# Altium project CurrentSource.PrjPcb
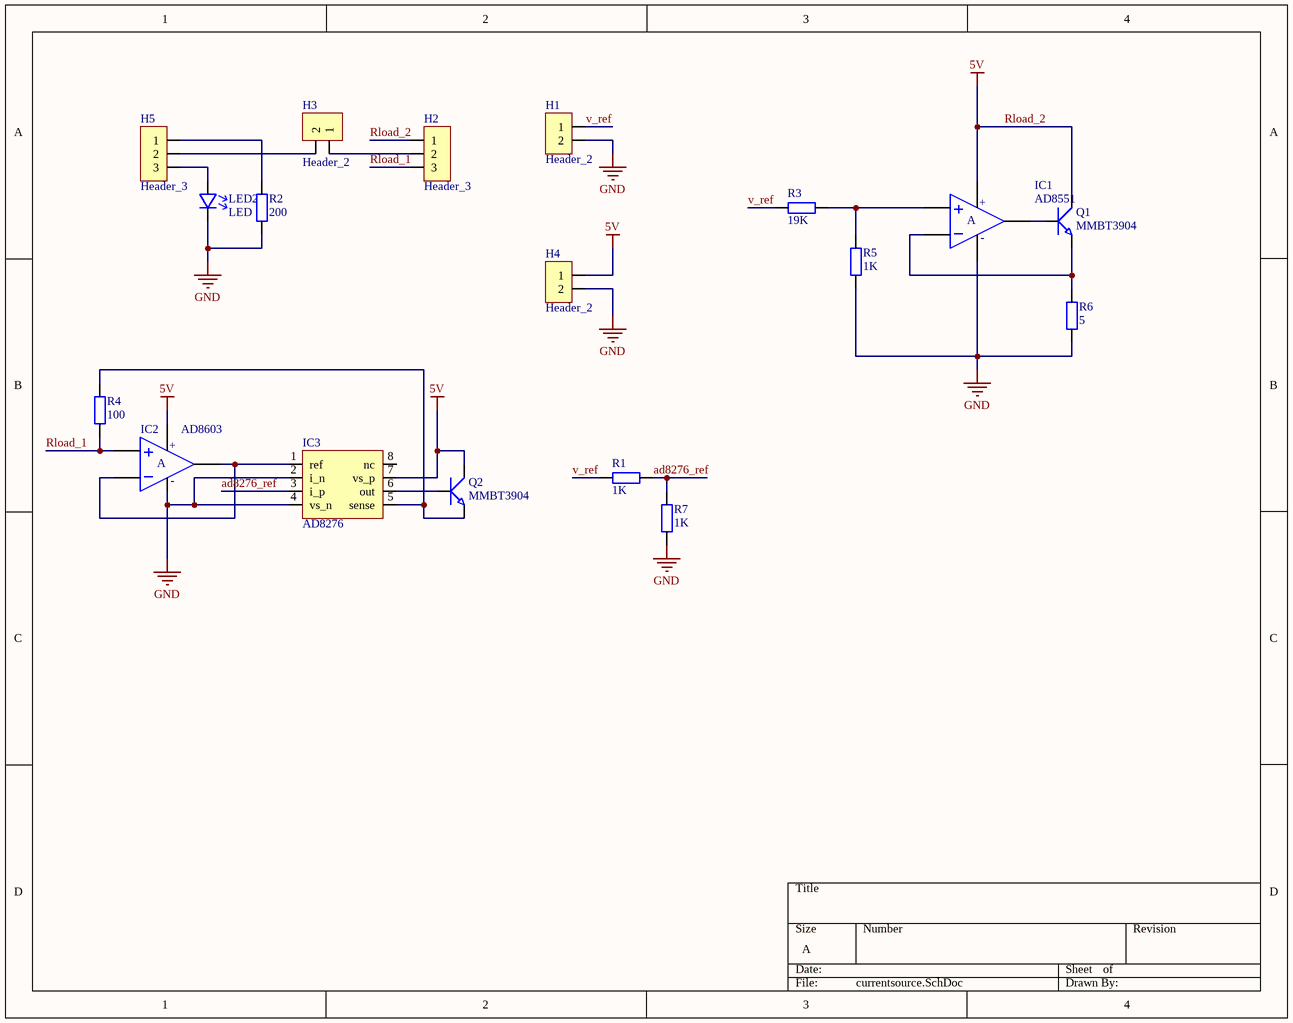
[diagram p0: currentsource.SchDoc]
1 sheet, 18 parts. Net scope: global (net labels, ports and power ports of the same name join across sheets).

## Sheet currentsource.SchDoc
size A

### Parts
H1  Header_2  [Header_Male_2_right]
H2  Header_3  [Header_MALE_3]
H3  Header_2  [Header_Male_2_right]
H4  Header_2  [Header_Male_2_right]
H5  Header_3  [Header_MALE_3]
IC1  AD8551  [8-SOIC]
IC2  AD8603  [5-TSOT]
IC3  AD8276  [8-SOIC]
LED2  LED  [LED_5MM_TROUGH]
Q1  MMBT3904  [3-SOT-23]
Q2  MMBT3904  [3-SOT-23]
R1  1K  [R0805]
R2  200  [R0805]
R3  19K  [R0805]
R4  100  [R0805]
R5  1K  [R0805]
R6  5  [R0805]
R7  1K  [R0805]

### Nets
GND: H1.2 H4.2 IC1.4(V-) IC2.2(V-) IC3.2(i_n) IC3.4(vs_n) LED2.C(Cathode) R2.2 R5.1 R6.2 R7.2
Rload_2: H2.1 H4.1 IC1.7(V+) IC2.5(V+) IC3.7(vs_p) Q1.3(Source) Q2.3(Source)  [also labelled 5V]
ad8276_ref: IC3.3(i_p) R1.2 R7.1
Rload_1: H2.3 IC2.3(+) R4.1
v_ref: H1.1 R1.1 R3.1
NetH2_2: H2.2 H3.1
NetH3_2: H3.2 H5.2
NetH5_1: H5.1 R2.1
NetH5_3: H5.3 LED2.A(Anode)
NetIC1_1: IC1.1 Q1.1(Base)
NetIC1_2: IC1.2(-) Q1.2(Emitter) R6.1
NetIC1_3: IC1.3(+) R3.2 R5.2
NetIC2_1: IC2.1(OUT) IC2.4(-) IC3.1(ref)
NetIC3_5: IC3.5(sense) Q2.2(Emitter) R4.2
NetIC3_6: IC3.6(out) Q2.1(Base)

Not connected (* = marked no-connect by the designer): IC3 8(nc)

### Notes on the sheet
- (in symbol AD8551ARZ) A
- (in symbol AD8603AUJZ) A

### Library data of the parts
H1 H3 H4 = Header_2: Generic 2pin header symbol; Supplier 1: Digi-Key; Supplier Part Number 1: S1012EC-40-ND
H2 H5 = Header_3: Generic 3pin header symbol; Supplier 1: Digi-Key; Supplier Part Number 1: S1012EC-40-ND
IC1 = AD8551ARZ: Zero  -Drift, Single  -Supply, Rail  -to-Rail   Input/Output Operational Amplifiers
IC2 = AD8603AUJZ: Rail-to-Rail Input/Output Operational Amplifier
IC3 = AD8276ARZ: Unity-Gain Difference Amplifier
LED2 = LED: Schematic symbol of a LED
Q1 Q2 = MMBT3904: 40V NPN SMALL SIGNAL TRANSISTOR IN SOT23
R1-R7 = Resistor: Schematic symbol of a resistor